# EAGLE design Fireworks_PCB_1.1 (EAGLE 8.4.1)
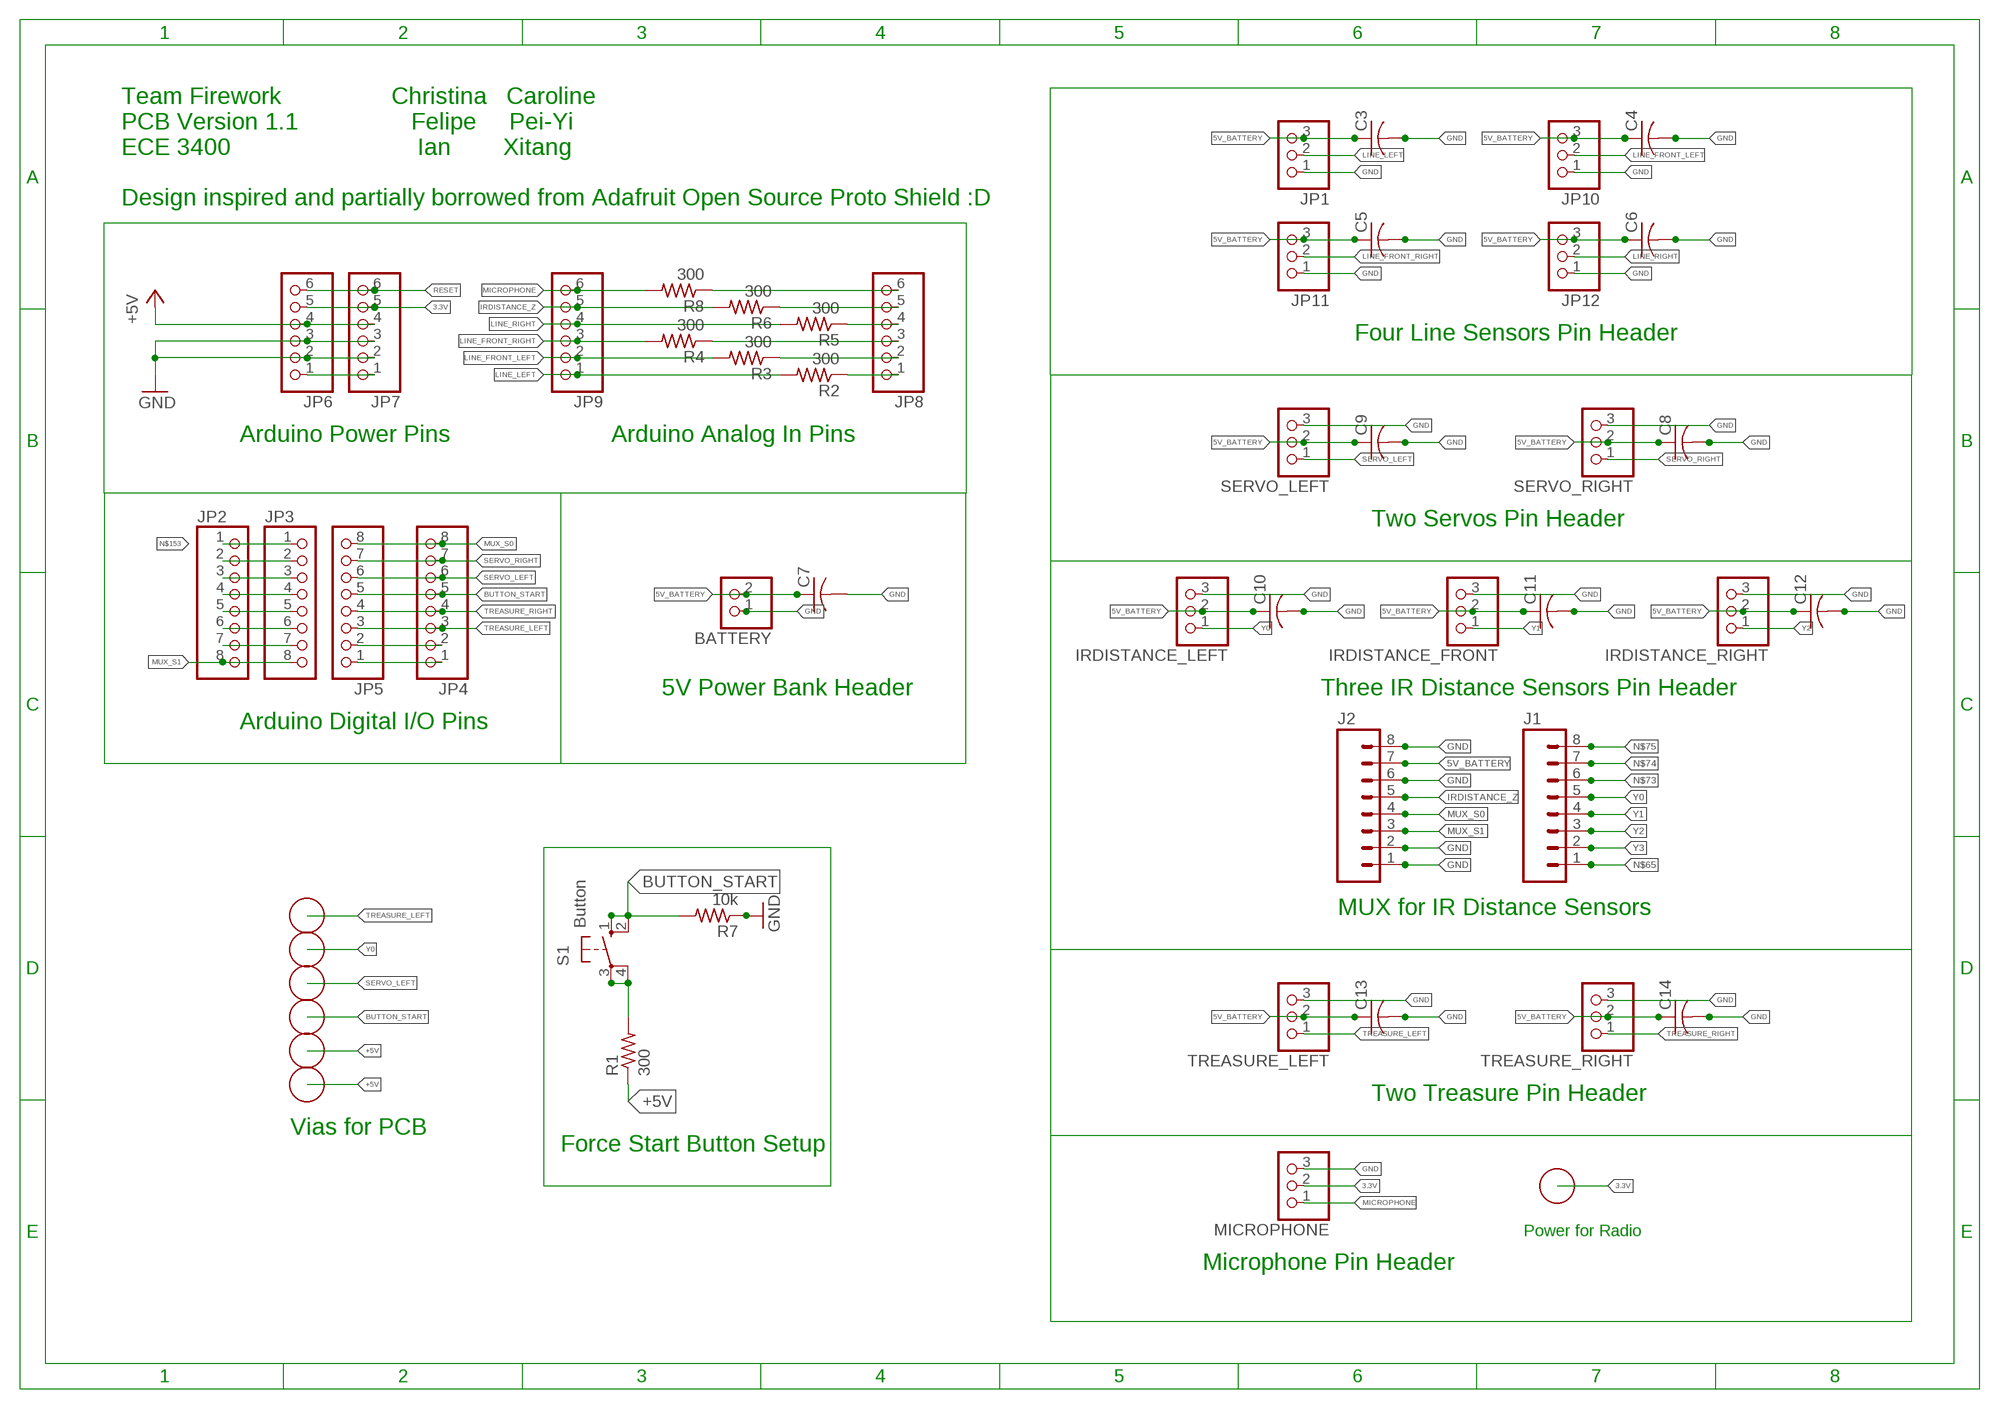
[diagram p0: schematic, sheet 1]

## Parts
BATTERY  PINHD-1X2  [1X02]
C3  C-US025-025X050  [C025-025X050]
C4  C-US025-025X050  [C025-025X050]
C5  C-US025-025X050  [C025-025X050]
C6  C-US025-025X050  [C025-025X050]
C7  C-US025-025X050  [C025-025X050]
C8  C-US025-025X050  [C025-025X050]
C9  C-US025-025X050  [C025-025X050]
C10  C-US025-025X050  [C025-025X050]
C11  C-US025-025X050  [C025-025X050]
C12  C-US025-025X050  [C025-025X050]
C13  C-US025-025X050  [C025-025X050]
C14  C-US025-025X050  [C025-025X050]
IRDISTANCE_FRONT  PINHD-1X3  [1X03]
IRDISTANCE_LEFT  PINHD-1X3  [1X03]
IRDISTANCE_RIGHT  PINHD-1X3  [1X03]
J1  M08  [1X08_ROUND]
J2  M08  [1X08_ROUND]
JP1  PINHD-1X3  [1X03]
JP2  PINHD-1X8B  [1X08-BIG]
JP3  PINHD-1X8CLEANBIG  [1X08-CLEANBIG]
JP4  PINHD-1X8B  [1X08-BIG]
JP5  PINHD-1X8CLEANBIG  [1X08-CLEANBIG]
JP6  PINHD-1X6CB  [1X06-CLEANBIG]
JP7  PINHD-1X6B  [1X06-BIG]
JP8  PINHD-1X6CB  [1X06-CLEANBIG]
JP9  PINHD-1X6B  [1X06-BIG]
JP10  PINHD-1X3  [1X03]
JP11  PINHD-1X3  [1X03]
JP12  PINHD-1X3  [1X03]
MICROPHONE  PINHD-1X3  [1X03]
R1  300  R-US_0207/5V  [0207/5V]
R2  300  R-US_0207/5V  [0207/5V]
R3  300  R-US_0207/5V  [0207/5V]
R4  300  R-US_0207/5V  [0207/5V]
R5  300  R-US_0207/5V  [0207/5V]
R6  300  R-US_0207/5V  [0207/5V]
R7  10k  R-US_0207/5V  [0207/5V]
R8  300  R-US_0207/5V  [0207/5V]
S1  Button  10-XX  [B3F-10XX]
SERVO_LEFT  PINHD-1X3  [1X03]
SERVO_RIGHT  PINHD-1X3  [1X03]
TREASURE_LEFT  PINHD-1X3  [1X03]
TREASURE_RIGHT  PINHD-1X3  [1X03]
U$1  PERF  [PERFHOLE]
U$2  PERF  [PERFHOLE]
U$3  PERF  [PERFHOLE]
U$4  PERF  [PERFHOLE]
U$5  PERF  [PERFHOLE]
U$6  PERF  [PERFHOLE]
U$23  PERF  [PERFHOLE]

## Nets
3.3V: JP6.5 JP7.5 MICROPHONE.2 U$23.P$1
5V_BATTERY: BATTERY.2 C3.1 C4.1 C5.1 C6.1 C7.1 C8.1 C9.1 C10.1 C11.1 C12.1 C13.1 C14.1 IRDISTANCE_FRONT.2 IRDISTANCE_LEFT.2 IRDISTANCE_RIGHT.2 J2.7 JP1.3 JP10.3 JP11.3 JP12.3 SERVO_LEFT.2 SERVO_RIGHT.2 TREASURE_LEFT.2 TREASURE_RIGHT.2
+5V: JP6.4 JP7.4 R1.1 U$4.P$1 U$5.P$1
BUTTON_START: JP4.5 JP5.5 R7.2 S1.1(S) S1.2(S1) U$3.P$1
GND: BATTERY.1 C3.2 C4.2 C5.2 C6.2 C7.2 C8.2 C9.2 C10.2 C11.2 C12.2 C13.2 C14.2 IRDISTANCE_FRONT.3 IRDISTANCE_LEFT.3 IRDISTANCE_RIGHT.3 J2.1 J2.2 J2.6 J2.8 JP1.1 JP6.2 JP6.3 JP7.2 JP7.3 JP10.1 JP11.1 JP12.1 MICROPHONE.3 R7.1 SERVO_LEFT.3 SERVO_RIGHT.3 TREASURE_LEFT.3 TREASURE_RIGHT.3
IRDISTANCE_Z: J2.5 JP9.5 R6.2
LINE_FRONT_LEFT: JP9.2 JP10.2 R3.2
LINE_FRONT_RIGHT: JP9.3 JP11.2 R4.2
LINE_LEFT: JP1.2 JP9.1 R2.2
LINE_RIGHT: JP9.4 JP12.2 R5.2
MICROPHONE: JP9.6 MICROPHONE.1 R8.2
MUX_S0: J2.4 JP4.8 JP5.8
MUX_S1: J2.3 JP2.8 JP3.8
N$1: R1.2 S1.3(P) S1.4(P1)
N$2: JP2.3 JP3.3
N$3: JP8.5 R6.1
N$4: JP8.4 R5.1
N$5: JP2.5 JP3.5
N$6: JP8.3 R4.1
N$15: JP6.1 JP7.1
N$55: JP2.4 JP3.4
N$56: JP2.2 JP3.2
N$65: J1.1
N$73: J1.6
N$74: J1.7
N$75: J1.8
N$77: JP8.6 R8.1
N$145: JP2.7 JP3.7
N$152: JP2.6 JP3.6
N$153: JP2.1 JP3.1
N$154: JP8.1 R2.1
N$164: JP8.2 R3.1
N$185: JP4.1 JP5.1
N$186: JP4.2 JP5.2
RESET: JP6.6 JP7.6
SERVO_LEFT: JP4.6 JP5.6 SERVO_LEFT.1 U$2.P$1
SERVO_RIGHT: JP4.7 JP5.7 SERVO_RIGHT.1
TREASURE_LEFT: JP4.3 JP5.3 TREASURE_LEFT.1 U$6.P$1
TREASURE_RIGHT: JP4.4 JP5.4 TREASURE_RIGHT.1
Y0: IRDISTANCE_LEFT.1 J1.5 U$1.P$1
Y1: IRDISTANCE_FRONT.1 J1.4
Y2: IRDISTANCE_RIGHT.1 J1.3
Y3: J1.2

## Notes on the sheet
- Team Firework
  PCB Version 1.1
  ECE 3400
- Christina   Caroline
     Felipe     Pei-Yi
      Ian        Xitang
- Design inspired and partially borrowed from Adafruit Open Source Proto Shield :D
- Four Line Sensors Pin Header
- Arduino Power Pins | Arduino Analog In Pins
- Two Servos Pin Header
- 5V Power Bank Header | Three IR Distance Sensors Pin Header
- Arduino Digital I/O Pins
- MUX for IR Distance Sensors
- Two Treasure Pin Header
- Vias for PCB
- Force Start Button Setup
- Power for Radio
- Microphone Pin Header

## Library data of the parts
BATTERY = pinhead:PINHD-1X2: PIN HEADER
C3-C14 = rcl-ez:C-US: CAPACITOR, American symbol
IRDISTANCE_FRONT IRDISTANCE_LEFT IRDISTANCE_RIGHT JP1 JP10-JP12 MICROPHONE SERVO_LEFT SERVO_RIGHT TREASURE_LEFT TREASURE_RIGHT = pinhead:PINHD-1X3: PIN HEADER
J1 J2 = SparkFun-Connectors:M08: Header 8 Standard 8-pin 0.1" header. Use with straight break away headers (SKU : PRT-00116), right angle break away headers (PRT-00553), swiss pins (PRT-00743), machine pins (PRT-00117), and female headers (PRT-00115).; PROD_ID: CONN-08437
JP2-JP5 = carduino:PINHD-1X8: PIN HEADER
JP6-JP9 = carduino:PINHD-1X6: PIN HEADER
R1-R8 = rcl-ez:R-US_: RESISTOR, American symbol
S1 = switch-omron:10-XX: OMRON SWITCH
U$1-U$6 U$23 = carduino:PERF

## Board
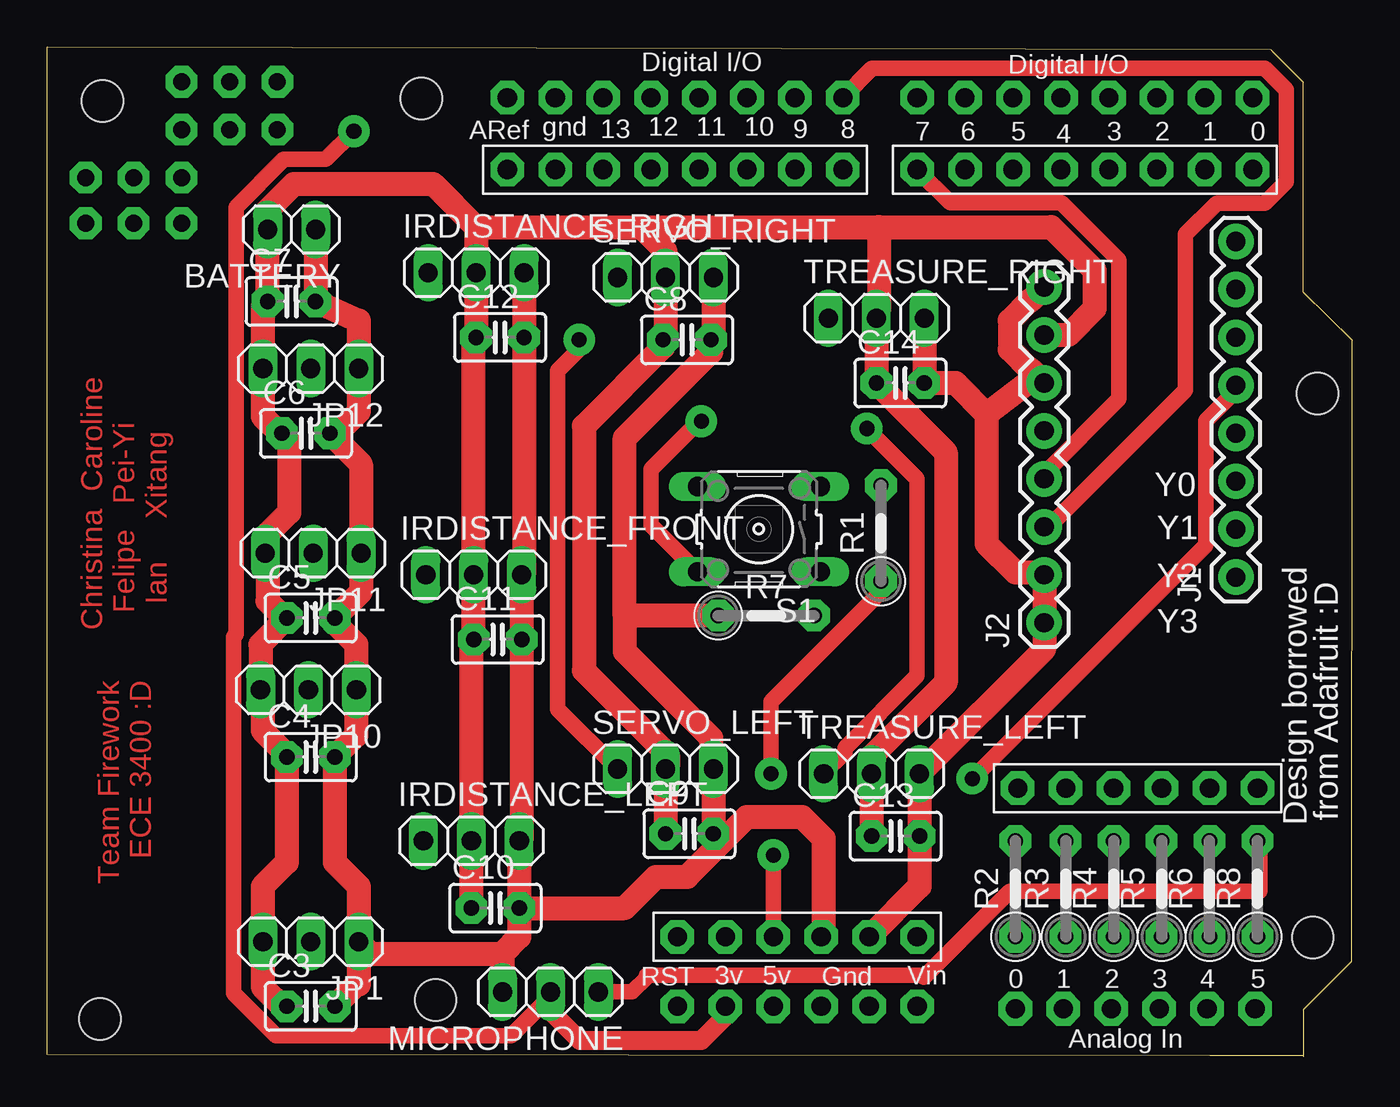
[diagram p1: board, top side]
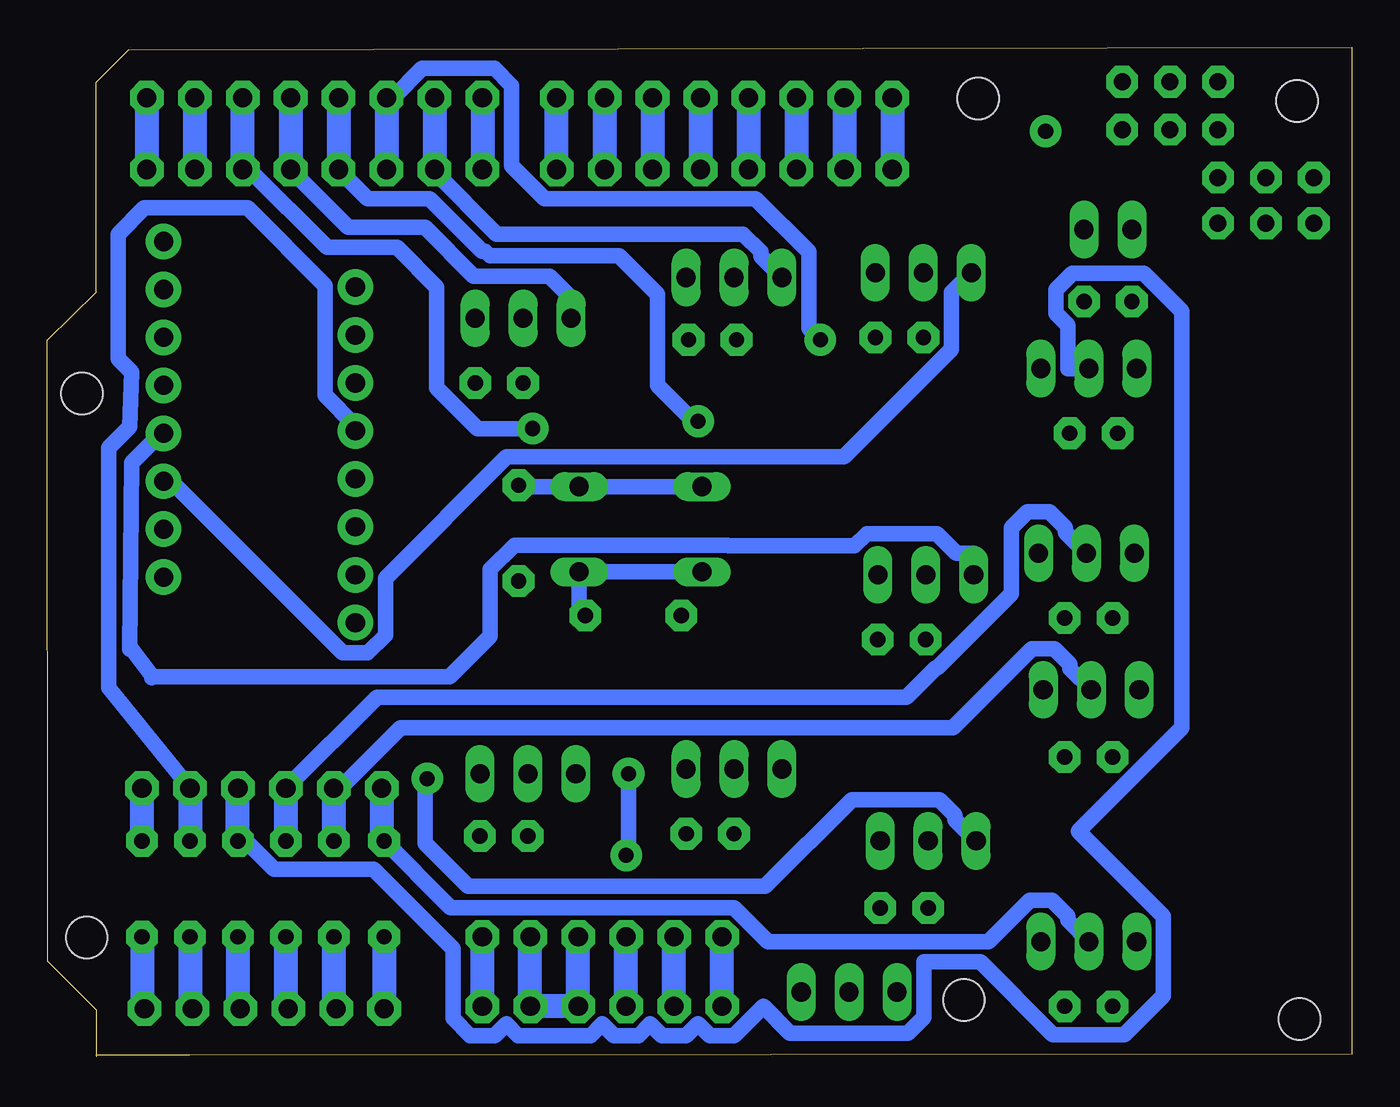
[diagram p2: board, bottom side, seen from below]

Size 69.16 x 53.48 mm. Coordinates in mm from the lower left corner, seen from the top.
Outline: 69.13,5.05 69.13,5.05
Outline: 69.13,5.05 69.16,37.95 66.55,40.49 66.55,51.63 64.83,53.35 0,53.48 0,0.13 61.6,0.09 66.58,0.08
Outline: 69.13,5.05 66.55,2.5 66.57,0
Copper layers (1*16): Top 0.035mm / dielectric 1.5mm / Bottom 0.035mm
Design rules "default": minimum track width 10mil, minimum drill 19mil, track to track 10mil, track to pad 10mil, pad to pad 0mil, via to via 10mil, smd to smd 0mil, copper to edge 10mil, drill to drill 8mil, minimum pad ring 10mil, minimum via ring 8mil, stop-mask expansion 4mil, vias tented up to drill 0mil, thermal gap 10mil
Holes 2.2 mm at 67.32,35.14 19.82,50.76 20.58,3.01 2.8,1.99 2.93,50.63 67.06,6.31

### Footprints (pad centres in the part's own frame; a part is rotated, then mirrored left to right if it is on the bottom)
1X02 = drill 1.016 long: 1 -1.27,0; 2 1.27,0
C025-025X050 = drill 0.813 pad 1.676 octagon: 1 -1.27,0; 2 1.27,0
1X03 = drill 1.016 long: 1 -2.54,0; 2 0,0; 3 2.54,0
1X08_ROUND = drill 1.016 pad 1.88: 1 0,0; 2 2.54,0; 3 5.08,0; 4 7.62,0; 5 10.16,0; 6 12.7,0; 7 15.24,0; 8 17.78,0
1X08-BIG = drill 1.016 pad 1.778 octagon: 1 -8.89,0; 2 -6.35,0; 3 -3.81,0; 4 -1.27,0; 5 1.27,0; 6 3.81,0; 7 6.35,0; 8 8.89,0
1X08-CLEANBIG = drill 1.016 pad 1.778 octagon: 1 -8.89,0; 2 -6.35,0; 3 -3.81,0; 4 -1.27,0; 5 1.27,0; 6 3.81,0; 7 6.35,0; 8 8.89,0
1X06-CLEANBIG = drill 1.016 pad 1.778 octagon: 1 -6.35,0; 2 -3.81,0; 3 -1.27,0; 4 1.27,0; 5 3.81,0; 6 6.35,0
1X06-BIG = drill 1.016 pad 1.778 octagon: 1 -6.35,0; 2 -3.81,0; 3 -1.27,0; 4 1.27,0; 5 3.81,0; 6 6.35,0
0207/5V = drill 0.813 pad 1.676 octagon: 1 -2.54,0; 2 2.54,0
B3F-10XX = drill 1.016 long: 1 -3.251,2.261; 2 3.251,2.261; 3 -3.251,-2.261; 4 3.251,-2.261
PERFHOLE = drill 0.8 pad 1.676: P$1 0,0

### Placement (x,y rotation side)
BATTERY  12.95,43.82 180 top
C3  13.97,2.67 0 top
C4  13.97,15.88 0 top
C5  13.97,23.25 0 top
C6  13.71,33.03 0 top
C7  12.95,40.01 0 top
C8  33.91,37.98 0 top
C9  34.03,11.82 0 top
C10  23.75,7.88 0 top
C11  23.87,22.1 0 top
C12  24,38.11 0 top
C13  44.95,11.69 0 top
C14  45.21,35.69 0 top
IRDISTANCE_FRONT  22.6,25.53 0 top
IRDISTANCE_LEFT  22.48,11.44 0 top
IRDISTANCE_RIGHT  22.73,41.53 0 top
J1  62.99,25.41 90 top
J2  52.83,22.99 90 top
JP1  13.97,6.1 180 top
JP2  33.27,47 0 top
JP3  33.27,50.81 0 top
JP4  54.99,47 180 top
JP5  54.99,50.81 180 top
JP6  39.75,2.67 180 top
JP7  39.75,6.36 180 top
JP8  57.65,2.55 0 top
JP9  57.78,14.23 0 top
JP10  13.84,19.44 180 top
JP11  14.09,26.68 180 top
JP12  13.97,36.45 180 top
MICROPHONE  26.67,3.43 180 top
R1  44.18,27.74 90 top
R2  51.3,8.9 90 top
R3  53.97,8.9 90 top
R4  56.51,8.9 90 top
R5  59.05,8.9 90 top
R6  61.59,8.9 90 top
R7  38.1,23.37 0 top
R8  64.13,8.9 90 top
S1  37.72,27.95 180 top
SERVO_LEFT  32.76,15.25 0 top
SERVO_RIGHT  32.76,41.28 0 top
TREASURE_LEFT  43.68,14.99 0 top
TREASURE_RIGHT  43.94,39.12 0 top
U$1  49.02,14.74 0 top
U$2  28.19,37.98 0 top
U$3  34.67,33.66 0 top
U$4  38.35,14.99 0 top
U$5  38.48,10.67 0 top
U$6  43.43,33.28 0 top
U$23  16.25,49.03 0 top

### Tracks (layer width: path | path; a pad name or v marks a point on that pad's centre or on a via)
3.3V
  Top 0.813: U$23.P$1 14.75,47.53 12.54,47.53 10,44.99 10,22.39 9.88,22.26 9.88,3.37 12.13,1.12 24.59,1.12 26.67,3.2 MICROPHONE.2
  Top 1.016: MICROPHONE.2 26.67,2.42 28.21,0.87 34.67,0.87 35.94,2.14 JP6.5
  Bottom 0.406: 35.94,2.8 JP6.5 | JP7.5 35.94,2.8 | 35.94,2.8 35.81,2.8
  Bottom 1.27: JP6.5 JP7.5
5V_BATTERY
  Top 1.27: C3.1 12.44,2.67 11.43,3.69 JP1.3 11.43,9.02 12.7,10.29 C4.1 12.7,16.01 11.43,17.28 11.43,19.31 JP10.3 11.3,21.85 C5.1 12.57,23.25 11.68,24.14 11.68,26.55 JP11.3 11.55,27.56 12.82,28.83 12.82,32.64 C6.1 12.32,33.03 11.43,33.91 JP12.3 11.43,39.76 C7.1 BATTERY.2 11.68,44.84 13.08,46.23 20.44,46.23 22.73,43.95 | C10.1 IRDISTANCE_LEFT.2 22.48,21.98 C11.1 IRDISTANCE_FRONT.2 22.6,37.98 C12.1 IRDISTANCE_RIGHT.2 22.73,43.95 | C13.1 TREASURE_LEFT.2 43.68,15.88 47.62,19.82 47.62,32.01 C14.1 TREASURE_RIGHT.2 43.81,39.25 44.07,39.5 44.07,43.95 | C9.1 SERVO_LEFT.2 32.89,15.37 32.89,16.01 28.44,20.45 28.44,33.41 32.64,37.6 C8.1 32.76,38.11 SERVO_RIGHT.2 32.76,42.68 31.49,43.95 | 22.73,43.95 31.49,43.95 | 31.49,43.95 44.07,43.95 | 44.07,43.95 53.21,43.95 55.5,41.66 55.5,39.63 54.1,38.23 J2.7
+5V
  Top 0.813: R1.1 44.18,24.63 38.35,18.8 U$4.P$1 | U$5.P$1 JP7.4
  Bottom 0.406: JP7.4 38.48,6.23 | 38.48,6.23 JP6.4 | 38.48,6.23 38.35,6.23
  Bottom 0.813: U$4.P$1 38.35,10.8 U$5.P$1
  Bottom 1.27: JP6.4 JP7.4
BUTTON_START
  Top 0.813: U$3.P$1 34.54,33.66 32,31.12 32,28.15 S1.2
  Bottom 0.813: S1.2 S1.1 40.97,23.7 R7.2 | U$3.P$1 34.92,33.66 36.83,35.57 36.83,40.39 38.86,42.42 45.7,42.42 45.96,42.68 46.12,42.68 48.89,45.45 52.17,45.45 JP4.5
  Bottom 1.27: JP5.5 JP4.5
GND
  Top 1.27: BATTERY.1 C7.2 16.51,38.99 JP12.1 16.51,34.17 15.36,33.03 C6.2 16.63,31.37 JP11.1 16.63,24.64 C5.2 15.24,22.99 16.38,21.85 JP10.1 16.38,17.02 C4.2 15.24,10.29 16.51,9.02 JP1.1 | JP1.1 16.51,3.82 16.38,3.82 C3.2 | IRDISTANCE_RIGHT.3 C12.2 25.27,25.66 IRDISTANCE_FRONT.3 C11.2 25.14,11.56 IRDISTANCE_LEFT.3 C10.2 | C10.2 25.02,6.36 24.13,5.47 | 24.13,5.47 MICROPHONE.3 | JP1.1 17.14,5.47 24.13,5.47 | SERVO_RIGHT.3 35.3,38.11 C8.2 35.18,37.34 30.6,32.77 30.6,23.37 | TREASURE_RIGHT.3 C14.2 48.13,35.69 49.78,34.04 | C9.2 SERVO_LEFT.3 35.18,15.37 35.18,16.9 30.6,21.47 30.6,23.37 | C9.2 35.94,11.82 35.94,11.56 33.91,9.53 32.25,9.53 30.6,7.88 C10.2 | JP7.3 41.14,6.48 41.14,11.56 40,12.71 37.08,12.71 36.19,11.82 C9.2 | R7.1 30.6,23.37 | 49.78,34.04 52.45,36.07 J2.6 52.12,36.4 52.07,36.4 51,37.47 51,38.99 52.07,40.06 52.12,40.06 J2.8 | 49.78,34.04 49.78,27.18 51.3,25.66 52.7,25.66 J2.2 J2.1 52.83,21.6 TREASURE_LEFT.3 C13.2 46.22,9.02 JP7.2
  Bottom 1.27: JP7.3 JP6.3 JP6.2 JP7.2
IRDISTANCE_Z
  Bottom 0.813: J2.5 52.83,33.43 54.43,35.03 54.43,40.85 58.54,44.96 64,44.96 65.4,43.57 65.4,36.98 64.67,36.25 64.79,33.36 65.9,32.26 65.9,19.56 JP9.5
  Bottom 1.27: JP9.5 R6.2
LINE_FRONT_LEFT
  Bottom 0.813: JP10.2 14.96,20.55 14.96,20.79 15.79,21.62 16.97,21.62 21.16,17.43 50.42,17.43 53.62,14.23 JP9.2
  Bottom 1.27: JP9.2 R3.2
LINE_FRONT_RIGHT
  Bottom 0.813: JP11.2 15.21,27.79 15.21,28.03 16.04,28.86 17.22,28.86 18.06,28.03 18.06,24.53 21.98,20.6 22.07,20.6 23.62,19.06 51.69,19.06 JP9.3
  Bottom 1.27: JP9.3 R4.2
LINE_LEFT
  Bottom 0.813: JP1.2 15.08,7.22 15.08,7.45 15.92,8.29 17.1,8.29 19.28,6.1 30.95,6.1 32.76,7.9 47.77,7.9 51.43,11.56
  Bottom 1.27: R2.2 51.43,11.56 JP9.1
LINE_RIGHT
  Bottom 0.813: R5.2 58.63,11.44 57.13,9.94 51.87,9.94 47.65,5.71 47.65,2.03 46.74,1.12 45.46,1.12 44.83,1.75 44.2,1.12 41.66,1.12 40.38,1.12 39.75,1.75 39.12,1.12 37.84,1.12 37.21,1.75 36.58,1.12 35.3,1.12 34.67,1.75 34.04,1.12 32.76,1.12 31.21,2.67 29.8,1.25 23.54,1.25 22.7,2.08 22.7,5.03 19.72,5.03 15.86,1.17 12.08,1.17 10,3.25 10,7.45 14.5,11.95 9.04,17.42 9.04,39.49 11.06,41.51 14.84,41.51 15.72,40.63 15.72,39.39 15.08,38.75 15.08,36.45 JP12.2
  Bottom 1.27: R5.2 JP9.4
MICROPHONE
  Top 0.813: MICROPHONE.1 30.98,3.43 31.75,4.2 31.75,4.32 46.35,4.32 46.45,4.22 51,8.77 64.26,8.77 64.26,11.31 R8.2
  Bottom 1.27: R8.2 JP9.6
MUX_S0
  Top 0.813: JP4.8 47.85,45.24 53.75,45.24 56.79,42.2 56.79,34.85 52.83,30.89 J2.4
  Bottom 0.406: 46.1,51.19 JP5.8 | 46.1,47.12 JP4.8
  Bottom 1.27: JP5.8 46.1,47.12
MUX_S1
  Top 0.813: JP3.8 43.71,52.35 64.13,52.35 64.52,52.35 65.66,51.22 65.66,46.36 64.51,45.22 61.97,45.22 60.32,43.57 60.32,35.31 53.08,28.07 J2.3
  Bottom 1.27: JP2.8 JP3.8
N$1
  Bottom 0.813: S1.4 S1.3 44.11,30.21 R1.2
N$2
  Bottom 0.406: 29.46,47.12 JP2.3
  Bottom 1.27: JP3.3 29.46,47.12
N$3
  Top 0.305: 61.59,2.93 61.59,2.67 JP8.5
  Bottom 1.27: R6.1 61.59,2.67 JP8.5
N$4
  Top 0.305: 59.05,2.8 59.05,2.67 JP8.4
  Bottom 1.27: R5.1 59.05,2.67 JP8.4
N$5
  Bottom 1.27: JP3.5 JP2.5
N$6
  Top 0.305: 56.51,2.67 JP8.3
  Bottom 1.27: R4.1 56.51,2.67 JP8.3
N$8  (via drill 0.9 pad 1.68)
  other vias: 12.2,51.65
N$11  (via drill 0.9 pad 1.68)
  other vias: 4.58,44.16
N$12  (via drill 0.9 pad 1.68)
  other vias: 2.04,44.16
N$13  (via drill 0.9 pad 1.68)
  other vias: 7.12,44.16
N$14  (via drill 0.9 pad 1.68)
  other vias: 9.66,51.65
N$15
  Bottom 1.27: JP6.1 JP7.1
N$16  (via drill 0.9 pad 1.68)
  other vias: 12.2,49.11
N$17  (via drill 0.9 pad 1.68)
  other vias: 9.66,49.11
N$42  (via drill 0.9 pad 1.68)
  other vias: 7.12,51.65
N$43  (via drill 0.9 pad 1.68)
  other vias: 7.12,49.11
N$45  (via drill 0.9 pad 1.68)
  other vias: 4.58,46.57
N$46  (via drill 0.9 pad 1.68)
  other vias: 2.04,46.57
N$47  (via drill 0.9 pad 1.68)
  other vias: 7.12,46.57
N$55
  Bottom 1.27: JP3.4 JP2.4
N$56
  Bottom 1.27: JP3.2 JP2.2
N$77
  Top 0.305: 64.13,2.93 64.13,2.67 JP8.6
  Bottom 1.27: R8.1 64.13,2.67 JP8.6
N$145
  Bottom 1.27: JP3.7 JP2.7
N$152
  Bottom 1.27: JP3.6 JP2.6
N$153
  Bottom 1.27: JP3.1 JP2.1
N$154
  Bottom 1.27: R2.1 JP8.1
N$164
  Top 0.305: 53.97,2.67 JP8.2
  Bottom 1.27: R3.1 53.97,2.67 JP8.2
N$185
  Bottom 1.27: JP5.1 JP4.1
N$186
  Bottom 0.406: 61.46,50.81 61.46,50.93 | 61.46,50.81 JP5.2 | JP4.2 61.46,47 61.46,50.81
  Bottom 1.27: JP5.2 JP4.2
RESET
  Bottom 0.406: JP7.6 33.4,6.23 | 33.4,6.23 JP6.6 | 33.4,6.23 33.52,6.23
  Bottom 1.27: JP6.6 JP7.6
SERVO_LEFT
  Top 0.813: 29.21,16.26 SERVO_LEFT.1 27.05,18.42 27.05,36.33 28.19,37.47 U$2.P$1
  Bottom 0.406: JP5.6 51.18,50.93
  Bottom 0.813: U$2.P$1 28.8,38.59 28.8,42.63 31.61,45.45 42.8,45.45 44.55,47.19 44.55,51.45 45.46,52.35 49.28,52.35 50.83,50.81 JP5.6
  Bottom 1.27: JP5.6 JP4.6
SERVO_RIGHT
  Bottom 0.406: 48.51,50.81 48.51,50.93 | 48.51,50.81 JP5.7 | JP4.7 48.51,47 48.51,50.81
  Bottom 0.813: SERVO_RIGHT.1 31.34,42.4 31.34,42.63 32.27,43.57 45.34,43.57 48.64,46.87 JP4.7
  Bottom 1.27: JP5.7 48.64,47.12 48.51,47
TREASURE_LEFT
  Top 0.813: TREASURE_LEFT.1 42.26,16.11 42.26,16.34 46.1,20.18 46.1,30.61 U$6.P$1
  Bottom 0.813: U$6.P$1 46.35,33.28 48.51,35.44 48.51,40.77 50.62,42.88 54.33,42.88 58.45,47 JP4.3
  Bottom 1.27: JP4.3 JP5.3
TREASURE_RIGHT
  Bottom 0.813: TREASURE_RIGHT.1 41.4,40.21 42.54,41.36 46.55,41.36 49.15,43.95 53.21,43.95 JP4.4
  Bottom 1.27: JP5.4 JP4.4
Y0
  Top 0.813: U$1.P$1 61.39,27.11 61.39,33.69 62.99,35.29 J1.5
  Bottom 0.813: IRDISTANCE_LEFT.1 21.05,12.55 21.05,12.79 21.89,13.62 26.51,13.62 31.11,9.02 46.86,9.02 49.15,11.31 49.15,14.61 U$1.P$1
Y1
  Bottom 0.813: IRDISTANCE_FRONT.1 20.06,26.68 20.97,26.68 22.01,27.72 25.73,27.72 26.39,27.06 33.06,27.06 33.11,27.11 44.39,27.11 45.68,25.82 45.68,22.27 47.82,20.12 63.57,20.12 | 63.57,20.12 63.62,20.07 | 63.57,20.12 64.72,21.65 64.79,21.58 64.67,31.47 63.12,33.03 J1.4
Y2
  Bottom 0.813: IRDISTANCE_RIGHT.1 21.23,40.49 21.23,37.48 26.94,31.78 44.8,31.78 51.23,25.35 51.23,22.33 52.17,21.39 53.49,21.39 62.58,30.49 J1.3

### Text on the board
Top: Christina Caroline / Felipe Pei-Yi / Ian Xitang | Team Firework / ECE 3400 :D
tPlace: Digital I/O | Digital I/O | ARef | gnd | 13 | 12 | 11 | 10 | 9 | 8 | 7 | 6 | 5 | 3 | 2 | 1 | 0 | 4 | Y0 | Y1 | Y2 | Y3 | from Adafruit :D | Design borrowed | RST | 3v | 5v | Vin | Gnd | 0 | 1 | 2 | 3 | 4 | 5 | Analog In